# Altium project FluidGuard(Tx).PrjPcb (part 2 of 2)

## Sheet USB-PD.SchDoc: USB-PD CHARGER
size A4; SheetNumber: 2; SheetTotal: 5; DOC_NO_SCH_DWG: #022024031001
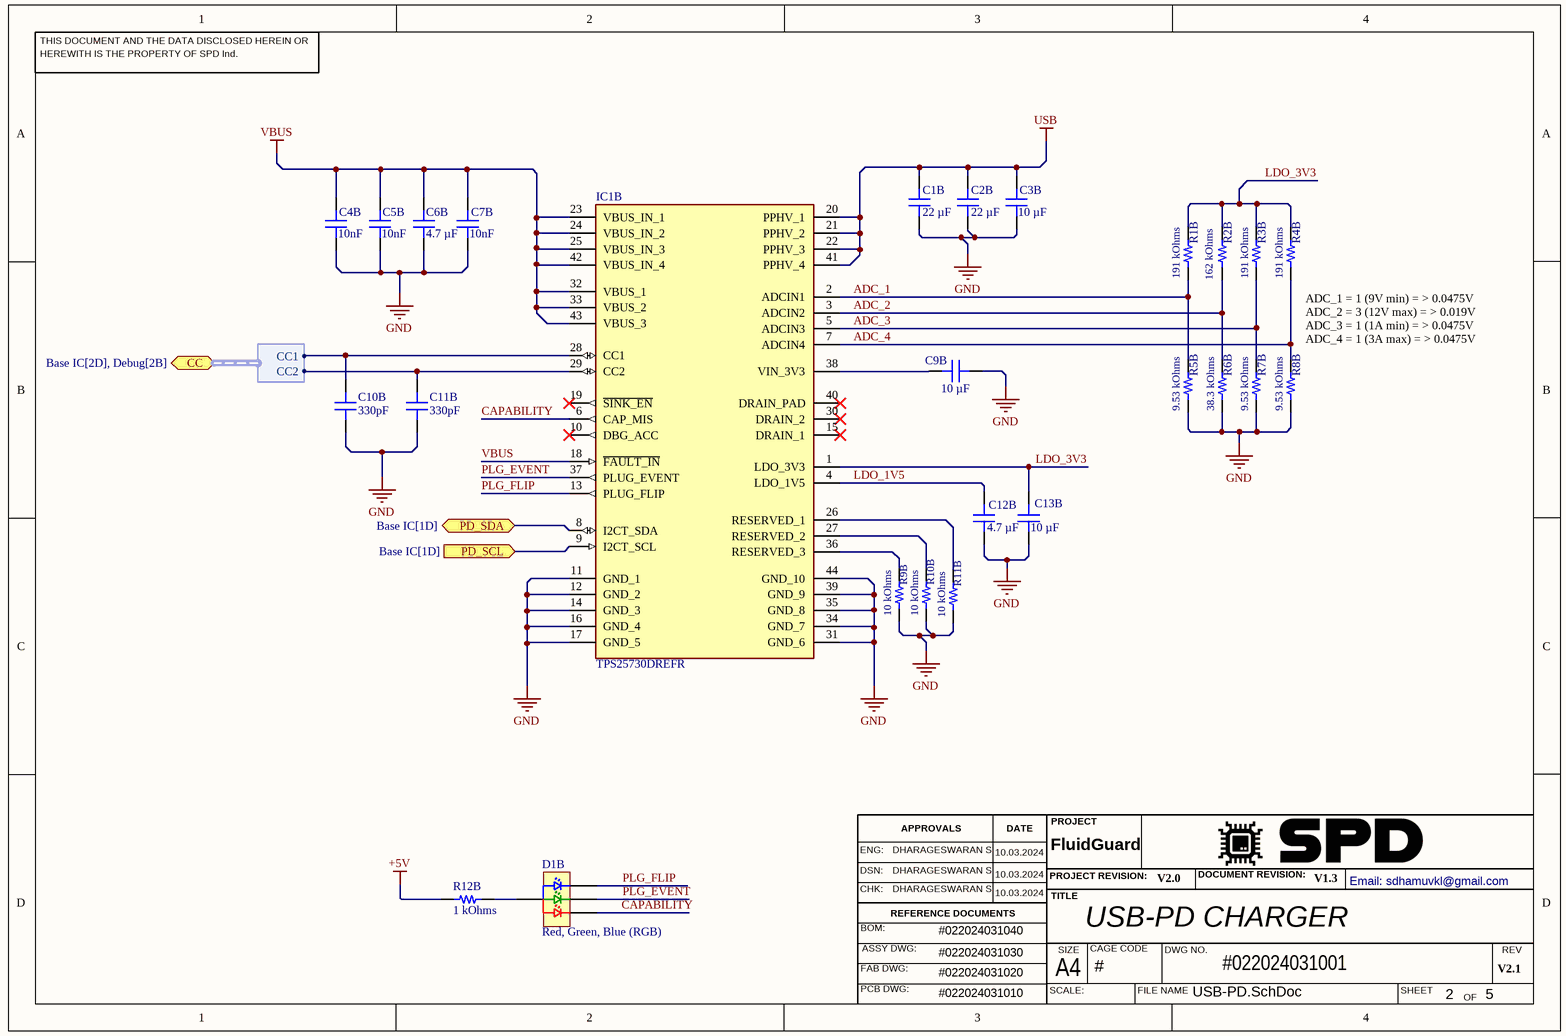
[diagram p3: USB-PD.SchDoc]

### Parts
C1B  22 µF  [CAP 0603_1608]
C2B  22 µF  [CAP 0603_1608]
C3B  10 µF  [CAP 0603_1608]
C4B  10nF  [CAP 0402_1005]
C5B  10nF  [CAP 0402_1005]
C6B  4.7 µF  [CAP 0402_1005]
C7B  10nF  [CAP 0402_1005]
C9B  10 µF  [CAP 0603_1608]
C10B  330pF  [CAP 0402_1005]
C11B  330pF  [CAP 0402_1005]
C12B  4.7 µF  [CAP 0402_1005]
C13B  10 µF  [CAP 0603_1608]
D1B  Red, Green, Blue (RGB)  [Harvatek B38G3RGB-10D0003H2U1930]
IC1B  TPS25730DREFR  [TPS25730DREFR]
R1B  191 kOhms  [RES 0402_1005]
R2B  162 kOhms  [RES 0402_1005]
R3B  191 kOhms  [RES 0402_1005]
R4B  191 kOhms  [RES 0402_1005]
R5B  9.53 kOhms  [RES 0402_1005]
R6B  38.3 kOhms  [RES 0402_1005]
R7B  9.53 kOhms  [RES 0402_1005]
R8B  9.53 kOhms  [RES 0402_1005]
R9B  10 kOhms  [RES 0402_1005]
R10B  10 kOhms  [RES 0402_1005]
R11B  10 kOhms  [RES 0402_1005]
R12B  1 kOhms  [RES 0603_1608]

### Ports
CC (bidir, harness CC, see Base IC[2D], Debug[2B]), PD_SCL (in, see Base IC[1D]), PD_SDA (bidir, see Base IC[1D])

### Harnesses
CC: CC1, CC2

### Nets
+5V: R12B.1
GND: C1B.1 C2B.1 C3B.2 C4B.1 C5B.1 C6B.1 C7B.1 C9B.1 C10B.1 C11B.1 C12B.1 C13B.1 IC1B.11(GND_1) IC1B.12(GND_2) IC1B.14(GND_3) IC1B.16(GND_4) IC1B.17(GND_5) IC1B.31(GND_6) IC1B.34(GND_7) IC1B.35(GND_8) IC1B.39(GND_9) IC1B.44(GND_10) R5B.1 R6B.1 R7B.1 R8B.1 R9B.2 R10B.2 R11B.2
USB: C1B.2 C2B.2 C3B.1 IC1B.20(PPHV_1) IC1B.21(PPHV_2) IC1B.22(PPHV_3) IC1B.41(PPHV_4)
VBUS: C4B.2 C5B.2 C6B.2 C7B.2 IC1B.18(~{FAULT_IN}) IC1B.23(VBUS_IN_1) IC1B.24(VBUS_IN_2) IC1B.25(VBUS_IN_3) IC1B.32(VBUS_1) IC1B.33(VBUS_2) IC1B.42(VBUS_IN_4) IC1B.43(VBUS_3)
ADC_1: IC1B.2(ADCIN1) R1B.1 R5B.2
ADC_2: IC1B.3(ADCIN2) R2B.1 R6B.2
ADC_3: IC1B.5(ADCIN3) R3B.1 R7B.2
ADC_4: IC1B.7(ADCIN4) R4B.1 R8B.2
CAPABILITY: D1B.4(RED) IC1B.6(CAP_MIS)
CC1: C10B.2 IC1B.28(CC1) ; port CC.CC1
CC2: C11B.2 IC1B.29(CC2) ; port CC.CC2
LDO_1V5: C12B.2 IC1B.4(LDO_1V5)
LDO_3V3: C13B.2 IC1B.1(LDO_3V3) R1B.2 R2B.2 R3B.2 R4B.2
PD_SCL: IC1B.9(I2CT_SCL) ; port PD_SCL
PD_SDA: IC1B.8(I2CT_SDA) ; port PD_SDA
PLG_EVENT: D1B.1(GREEN) IC1B.37(PLUG_EVENT)
PLG_FLIP: D1B.2(BLUE) IC1B.13(PLUG_FLIP)
NetC9B_2: C9B.2 IC1B.38(VIN_3V3)
NetD1B_3: D1B.3(ANODE) R12B.2
NetIC1B_26: IC1B.26(RESERVED_1) R11B.1
NetIC1B_27: IC1B.27(RESERVED_2) R10B.1
NetIC1B_36: IC1B.36(RESERVED_3) R9B.1

Not connected (* = marked no-connect by the designer): IC1B 10(DBG_ACC)* 15(DRAIN_1)* 19(~{SINK_EN})* 30(DRAIN_2)* 40(DRAIN_PAD)*

### Notes on the sheet
- ADC_1 = 1 (9V min) = > 0.0475V
  ADC_2 = 3 (12V max) = > 0.019V
  ADC_3 = 1 (1A min) = > 0.0475V
  ADC_4 = 1 (3A max) = > 0.0475V
- THIS DOCUMENT AND THE DATA DISCLOSED HEREIN OR
- HEREWITH IS THE PROPERTY OF SPD Ind.
- ENG:
- DHARAGESWARAN S
- APPROVALS
- DATE
- PROJECT
- DSN:
- CHK:
- REFERENCE DOCUMENTS
- PROJECT REVISION:
- TITLE
- DOCUMENT REVISION:
- Email: sdhamuvkl@gmail.com <https://github.com/DhamuVkl>
- BOM:
- FAB DWG:
- PCB DWG:
- ASSY DWG:
- SCALE:
- A4
- SIZE
- CAGE CODE
- FILE NAME
- DWG NO.
- SHEET
- REV
- OF

### Library data of the parts
C1B C2B = CL10A226MO7JZNC: CAP CER 22UF 16V X5R 0603; Manufacturer: Samsung Electro-Mechanics; id: 3280; Tolerance: ±20%; Part Number: CL10A226MO7JZNC; Value: 22 µF; Temperature Coefficient: X5R; Supplier Part Number 1: 1276-7076-1-ND; ComponentLink2Description: DigiKey Link; ComponentLink1URL: http://www.samsungsem.com/kr/support/product-search/mlcc/CL10A226MO7JZNC.jsp; PartId: 15245; Supplier 1: DigiKey; Series: CL; LastUpdated: 2023-01-03T20:07:09.957; Part Status: Active; Capacitance: 22 µF; Device Package: 0603 (1608 Metric); Thickness (Max): 0.031" (0.80mm); Voltage - Rated: 16V; Minimum Order: 1; Packaging: TapeAndReel; Applications: General Purpose; Package / Case: 0603 (1608 Metric); ComponentLink1Description: Datasheet; Price: 0.14; ComponentLink2URL: https://www.digikey.com/en/products/detail/samsung-electro-mechanics/CL10A226MO7JZNC/7320581; Lifecycle Status: Active; Operating Temperature: -55°C ~ 85°C; Size / Dimension: 0.063" L x 0.031" W (1.60mm x 0.80mm); Mounting Type: Surface Mount, MLCC
C3B C9B C13B = GRM188R61E106KA73D: CAP CER 10UF 25V X5R 0603; Manufacturer: Murata Electronics; id: 2462; Tolerance: ±10%; Part Number: GRM188R61E106KA73D; Value: 10 µF; Temperature Coefficient: X5R; Supplier Part Number 1: 490-18214-1-ND; ComponentLink2Description: DigiKey Link; ComponentLink1URL: https://search.murata.co.jp/Ceramy/image/img/A01X/G101/ENG/GRM188R61E106KA73-01.pdf; PartId: 12669; Supplier 1: DigiKey; Series: GRM; LastUpdated: 2023-01-03T20:07:18.763; Part Status: Active; Capacitance: 10 µF; Device Package: 0603 (1608 Metric); Thickness (Max): 0.039" (1.00mm); Voltage - Rated: 25V; Minimum Order: 1; Packaging: TapeAndReel; Applications: General Purpose; Package / Case: 0603 (1608 Metric); ComponentLink1Description: Datasheet; Price: 0.04; ComponentLink2URL: https://www.digikey.com/en/products/detail/murata-electronics/GRM188R61E106KA73D/9867922; Lifecycle Status: Active; Operating Temperature: -55°C ~ 85°C; Size / Dimension: 0.063" L x 0.031" W (1.60mm x 0.80mm); Mounting Type: Surface Mount, MLCC
C4B C5B C7B = C0402C103J5RECAUTO: CAP CER 0402 10NF 50V X7R 5%; Manufacturer: KEMET; id: 3927; Value: 10000 pF; Part Number: C0402C103J5RECAUTO; Temperature Coefficient: X7R; Supplier Part Number 1: 399-C0402C103J5RECAUTOCT-ND; ComponentLink2Description: DigiKey Link; ComponentLink1URL: https://api.kemet.com/component-edge/download/datasheet/C0402C103J5RECAUTO.pdf; PartId: 33153; Tolerance: ±5%; Supplier 1: DigiKey; Series: ESD SMD Auto X7R; LastUpdated: 2023-01-03T20:03:32.240; Part Status: Active; Capacitance: 10000 pF; Device Package: 0402 (1005 Metric); Ratings: AEC-Q200; Thickness (Max): 0.022" (0.55mm); Voltage - Rated: 50V; Minimum Order: 1; Packaging: TapeAndReel; Applications: Automotive, ESD Protection; Package / Case: 0402 (1005 Metric); ComponentLink1Description: Datasheet; Price: 0.02; ComponentLink2URL: https://www.digikey.com/en/products/detail/kemet/C0402C103J5RECAUTO/8646448; Lifecycle Status: Active; Operating Temperature: -55°C ~ 125°C; Size / Dimension: 0.039" L x 0.020" W (1.00mm x 0.50mm); Mounting Type: Surface Mount, MLCC
C6B C12B = GMC04X5R475K10NT: CAP0402 X5R 4.7UF 10% 10V; Manufacturer: Cal-Chip Electronics, Inc.; id: 6422; Part Number: GMC04X5R475K10NT; Value: 4.7 µF; Temperature Coefficient: X5R; Supplier Part Number 1: 4713-GMC04X5R475K10NTCT-ND; ComponentLink2Description: DigiKey Link; ComponentLink1URL: https://88ce57.p3cdn1.secureserver.net/wp-content/uploads/2023/01/gmc_series-2.pdf; PartId: 49814; Tolerance: ±10%; Supplier 1: DigiKey; Series: GMC; LastUpdated: 2023-04-21T19:03:30.743; Part Status: Active; Capacitance: 4.7 µF; Device Package: 0402 (1005 Metric); Thickness (Max): 0.028" (0.70mm); Voltage - Rated: 10V; Minimum Order: 1; Packaging: TapeAndReel; Applications: General Purpose; Package / Case: 0402 (1005 Metric); ComponentLink1Description: Datasheet; Price: 0.01; ComponentLink2URL: https://www.digikey.com/en/products/detail/cal-chip-electronics-inc/GMC04X5R475K10NT/18151135; Lifecycle Status: Active; Operating Temperature: -55°C ~ 85°C; Size / Dimension: 0.039" L x 0.020" W (1.00mm x 0.50mm); Mounting Type: Surface Mount, MLCC
C10B C11B = 0402YA331JAT2A: CAP CER 330PF 16V NP0 0402; Manufacturer: AVX Corporation; id: 3428; Temperature Coefficient: C0G, NP0; Tolerance: ±5%; Part Number: 0402YA331JAT2A; Value: 330pF; Supplier Part Number 1: 478-0402YA331JAT2ACT-ND; ComponentLink2Description: DigiKey Link; ComponentLink1URL: http://datasheets.avx.com/C0GNP0-Dielectric.pdf; PartId: 27100; Supplier 1: DigiKey; Series: -; LastUpdated: 2022-02-08T12:26:34.560; Part Status: Active; Capacitance: 330pF; Device Package: 0402 (1005 Metric); Voltage - Rated: 16V; Minimum Order: 1; Packaging: TapeAndReel; Applications: General Purpose; Package / Case: 0402 (1005 Metric); ComponentLink1Description: Datasheet; Price: 0.01; ComponentLink2URL: http://digikey.com/product-detail/en/avx-corporation/0402YA331JAT2A/478-0402YA331JAT2ACT-ND/11570207; Lifecycle Status: Active; Operating Temperature: -55°C ~ 125°C; Mounting Type: Surface Mount, MLCC
D1B = B38G3RGB-10D0003H2U1930: LED RGB MIXED WHITE ( 1.6(L)X1.6; Manufacturer: Harvatek Corporation; id: 1399; Lens Style: Rectangle with Flat Top; Lens Size: 1.60mm x 1.10mm; Configuration: Common Anode; Voltage - Forward (Vf) (Typ): 2V Red, 3V Green, 3V Blue; Current - Test: 10mA Red, 10mA Green, 10mA Blue; Millicandela Rating: 630mcd Red, 630mcd Green, 630mcd Blue; Part Number: B38G3RGB-10D0003H2U1930; Supplier Part Number 1: 3147-B38G3RGB-10D0003H2U1930CT-ND; Supplier Device Package: 0606; ComponentLink1Description: Datasheet; Color: Red, Green, Blue (RGB); ComponentLink2URL: https://www.digikey.com/en/products/detail/harvatek-corporation/B38G3RGB-10D0003H2U1930/13588733; ComponentLink1URL: https://media.digikey.com/pdf/Data%20Sheets/Harvatek%20PDFs/B38G3RGB-10D0003H2U1930%20%20V1.9.pdf; Supplier 1: DigiKey; Series: -; Height (Max): 0.50mm; Part Status: Active; ComponentLink2Description: DigiKey Link; Packaging: TapeAndReel; Minimum Order: 1; PartId: 1416; Lifecycle Status: Active; LastUpdated: 2023-10-31T16:54:14.060; Value: Red, Green, Blue (RGB); Size / Dimension: 1.60mm L x 1.60mm W; Mounting Type: Surface Mount; Price: 0.11
IC1B = TPS25730DREFR: USB PD Controller; Manufacturer_Name: Texas Instruments; Datasheet Link: https://www.ti.com/lit/ds/symlink/tps25730.pdf?ts=1707773923998&ref_url=https%253A%252F%252Fwww.mouser.at%252F; Height: 0.8mm; Manufacturer_Part_Number: TPS25730DREFR; Mouser Part Number: 595-TPS25730DREFR; Mouser Price/Stock: https://www.mouser.co.uk/ProductDetail/Texas-Instruments/TPS25730DREFR?qs=Z%252BL2brAPG1IvmkUK7DRnBA%3D%3D; Supplier 1: Mouser; Supplier Part Number 1: 595-TPS25730DREFR
R1B R3B R4B = AC0402FR-07191KL: RES SMD 191K OHM 1% 1/16W 0402; Manufacturer: Yageo; id: 11854; Temperature Coefficient: ±100ppm/°C; Power (Watts): 0.063W, 1/16W; Part Number: AC0402FR-07191KL; Height - Seated (Max): 0.015" (0.37mm); Supplier Part Number 1: 13-AC0402FR-07191KLCT-ND; Supplier Device Package: 0402; ComponentLink1Description: Datasheet; ComponentLink2URL: https://www.digikey.com/en/products/detail/yageo/AC0402FR-07191KL/5895119; Features: Automotive AEC-Q200, Moisture Resistant; ComponentLink1URL: https://www.yageo.com/upload/media/product/productsearch/datasheet/rchip/PYu-AC_51_RoHS_L_8.pdf; Composition: Thick Film; Tolerance: ±1%; Supplier 1: DigiKey; Series: AC; Part Status: Active; ComponentLink2Description: DigiKey Link; Device Package: 0402 (1005 Metric); Packaging: CutTape; Ratings: AEC-Q200; Minimum Order: 1; Package / Case: 0402 (1005 Metric); PartId: 60441; Lifecycle Status: Active; LastUpdated: 2023-01-02T20:20:21.097; Operating Temperature: -55°C ~ 155°C; Number Of Terminations: 2; Value: 191 kOhms; Size / Dimension: 0.039" L x 0.020" W (1.00mm x 0.50mm); Price: 0.01; Resistance: 191 kOhms
R2B = CR0402-FX-1623GLF: RES SMD 162K OHM 1% 1/16W 0402; Manufacturer: Bourns Inc.; id: 4470; Temperature Coefficient: ±100ppm/°C; Power (Watts): 0.063W, 1/16W; Part Number: CR0402-FX-1623GLF; Height - Seated (Max): 0.016" (0.40mm); Supplier Part Number 1: CR0402-FX-1623GLFCT-ND; Supplier Device Package: 0402; ComponentLink1Description: Datasheet; ComponentLink2URL: https://www.digikey.com/en/products/detail/bourns-inc/CR0402-FX-1623GLF/3783178; ComponentLink1URL: https://www.bourns.com/docs/Product-Datasheets/CR0402.pdf; Composition: Thick Film; Tolerance: ±1%; Supplier 1: DigiKey; Series: CR0402; Part Status: Active; ComponentLink2Description: DigiKey Link; Device Package: 0402 (1005 Metric); Packaging: CutTape; Minimum Order: 1; Package / Case: 0402 (1005 Metric); PartId: 11053; Lifecycle Status: Active; LastUpdated: 2023-01-02T20:21:14.190; Operating Temperature: -55°C ~ 155°C; Number Of Terminations: 2; Value: 162 kOhms; Size / Dimension: 0.039" L x 0.020" W (1.00mm x 0.50mm); Price: 0.01; Resistance: 162 kOhms
R5B R7B R8B = CRCW04029K53FKEDC: RES 9.53K OHM 1% 1/16W 0402; Manufacturer: Vishay Dale; id: 12430; Temperature Coefficient: ±100ppm/°C; Power (Watts): 0.063W, 1/16W; Part Number: CRCW04029K53FKEDC; Height - Seated (Max): 0.014" (0.35mm); Supplier Part Number 1: 541-5131-1-ND; Supplier Device Package: 0402; ComponentLink1Description: Datasheet; ComponentLink2URL: https://www.digikey.com/en/products/detail/vishay-dale/CRCW04029K53FKEDC/7925987; ComponentLink1URL: https://www.vishay.com/docs/28773/crcwce3.pdf; Composition: Thick Film; Tolerance: ±1%; Supplier 1: DigiKey; Series: CRCW-C; Part Status: Active; ComponentLink2Description: DigiKey Link; Device Package: 0402 (1005 Metric); Packaging: CutTape; Minimum Order: 1; Package / Case: 0402 (1005 Metric); PartId: 66777; Lifecycle Status: Active; LastUpdated: 2023-01-02T20:20:02.490; Operating Temperature: -55°C ~ 155°C; Number Of Terminations: 2; Value: 9.53 kOhms; Size / Dimension: 0.039" L x 0.020" W (1.00mm x 0.50mm); Price: 0.10; Resistance: 9.53 kOhms
R6B = AC0402FR-0738K3L: RES SMD 38.3K OHM 1% 1/16W 0402; Manufacturer: Yageo; id: 12409; Temperature Coefficient: ±100ppm/°C; Power (Watts): 0.063W, 1/16W; Part Number: AC0402FR-0738K3L; Height - Seated (Max): 0.015" (0.37mm); Supplier Part Number 1: 13-AC0402FR-0738K3LCT-ND; Supplier Device Package: 0402; ComponentLink1Description: Datasheet; ComponentLink2URL: https://www.digikey.com/en/products/detail/yageo/AC0402FR-0738K3L/5895312; Features: Automotive AEC-Q200, Moisture Resistant; ComponentLink1URL: https://www.yageo.com/upload/media/product/productsearch/datasheet/rchip/PYu-AC_51_RoHS_L_8.pdf; Composition: Thick Film; Tolerance: ±1%; Supplier 1: DigiKey; Series: AC; Part Status: Active; ComponentLink2Description: DigiKey Link; Device Package: 0402 (1005 Metric); Packaging: CutTape; Ratings: AEC-Q200; Minimum Order: 1; Package / Case: 0402 (1005 Metric); PartId: 65263; Lifecycle Status: Active; LastUpdated: 2023-01-02T20:20:08.577; Operating Temperature: -55°C ~ 155°C; Number Of Terminations: 2; Value: 38.3 kOhms; Size / Dimension: 0.039" L x 0.020" W (1.00mm x 0.50mm); Price: 0.01; Resistance: 38.3 kOhms
R9B R10B R11B = AC0402FR-1310KL: RES 10K OHM 1% 1/16W 0402; Manufacturer: Yageo; id: 13132; Temperature Coefficient: ±100ppm/°C; Power (Watts): 0.063W, 1/16W; Part Number: AC0402FR-1310KL; Height - Seated (Max): 0.015" (0.37mm); Supplier Part Number 1: 13-AC0402FR-1310KLCT-ND; Supplier Device Package: 0402; ComponentLink1Description: Datasheet; ComponentLink2URL: https://www.digikey.com/en/products/detail/yageo/AC0402FR-1310KL/12756397; Features: Automotive AEC-Q200, Moisture Resistant; ComponentLink1URL: https://www.yageo.com/upload/media/product/productsearch/datasheet/rchip/PYu-AC_51_RoHS_L_8.pdf; Composition: Thick Film; Tolerance: ±1%; Supplier 1: DigiKey; Series: AC; Part Status: Active; ComponentLink2Description: DigiKey Link; Device Package: 0402 (1005 Metric); Packaging: CutTape; Ratings: AEC-Q200; Minimum Order: 1; Package / Case: 0402 (1005 Metric); PartId: 69220; Lifecycle Status: Active; LastUpdated: 2023-01-02T20:19:54.633; Operating Temperature: -55°C ~ 155°C; Number Of Terminations: 2; Value: 10 kOhms; Size / Dimension: 0.039" L x 0.020" W (1.00mm x 0.50mm); Price: 0.01; Resistance: 10 kOhms
R12B = RMCF0603JT1K00: RES 1K OHM 5% 1/10W 0603; Manufacturer: Stackpole Electronics Inc; id: 454; Temperature Coefficient: ±200ppm/°C; Power (Watts): 0.1W, 1/10W; Part Number: RMCF0603JT1K00; Height - Seated (Max): 0.022" (0.55mm); Supplier Part Number 1: RMCF0603JT1K00CT-ND; Supplier Device Package: 0603; ComponentLink1Description: Datasheet; ComponentLink2URL: https://www.digikey.com/en/products/detail/stackpole-electronics-inc/RMCF0603JT1K00/1758057; Features: Automotive AEC-Q200; ComponentLink1URL: https://www.seielect.com/catalog/sei-rmcf_rmcp.pdf; Composition: Thick Film; Tolerance: ±5%; Supplier 1: DigiKey; Series: RMCF; Part Status: Active; ComponentLink2Description: DigiKey Link; Device Package: 0603 (1608 Metric); Packaging: CutTape; Ratings: AEC-Q200; Minimum Order: 1; Package / Case: 0603 (1608 Metric); PartId: 5824; Lifecycle Status: Active; LastUpdated: 2023-01-02T20:30:23.167; Operating Temperature: -55°C ~ 155°C; Number Of Terminations: 2; Value: 1 kOhms; Size / Dimension: 0.061" L x 0.031" W (1.55mm x 0.80mm); Price: 0.01; Resistance: 1 kOhms

## Sheet BMS.SchDoc: BMS BLOCK
size A4; SheetNumber: 4; SheetTotal: 5; DOC_NO_SCH_DWG: #022024031003
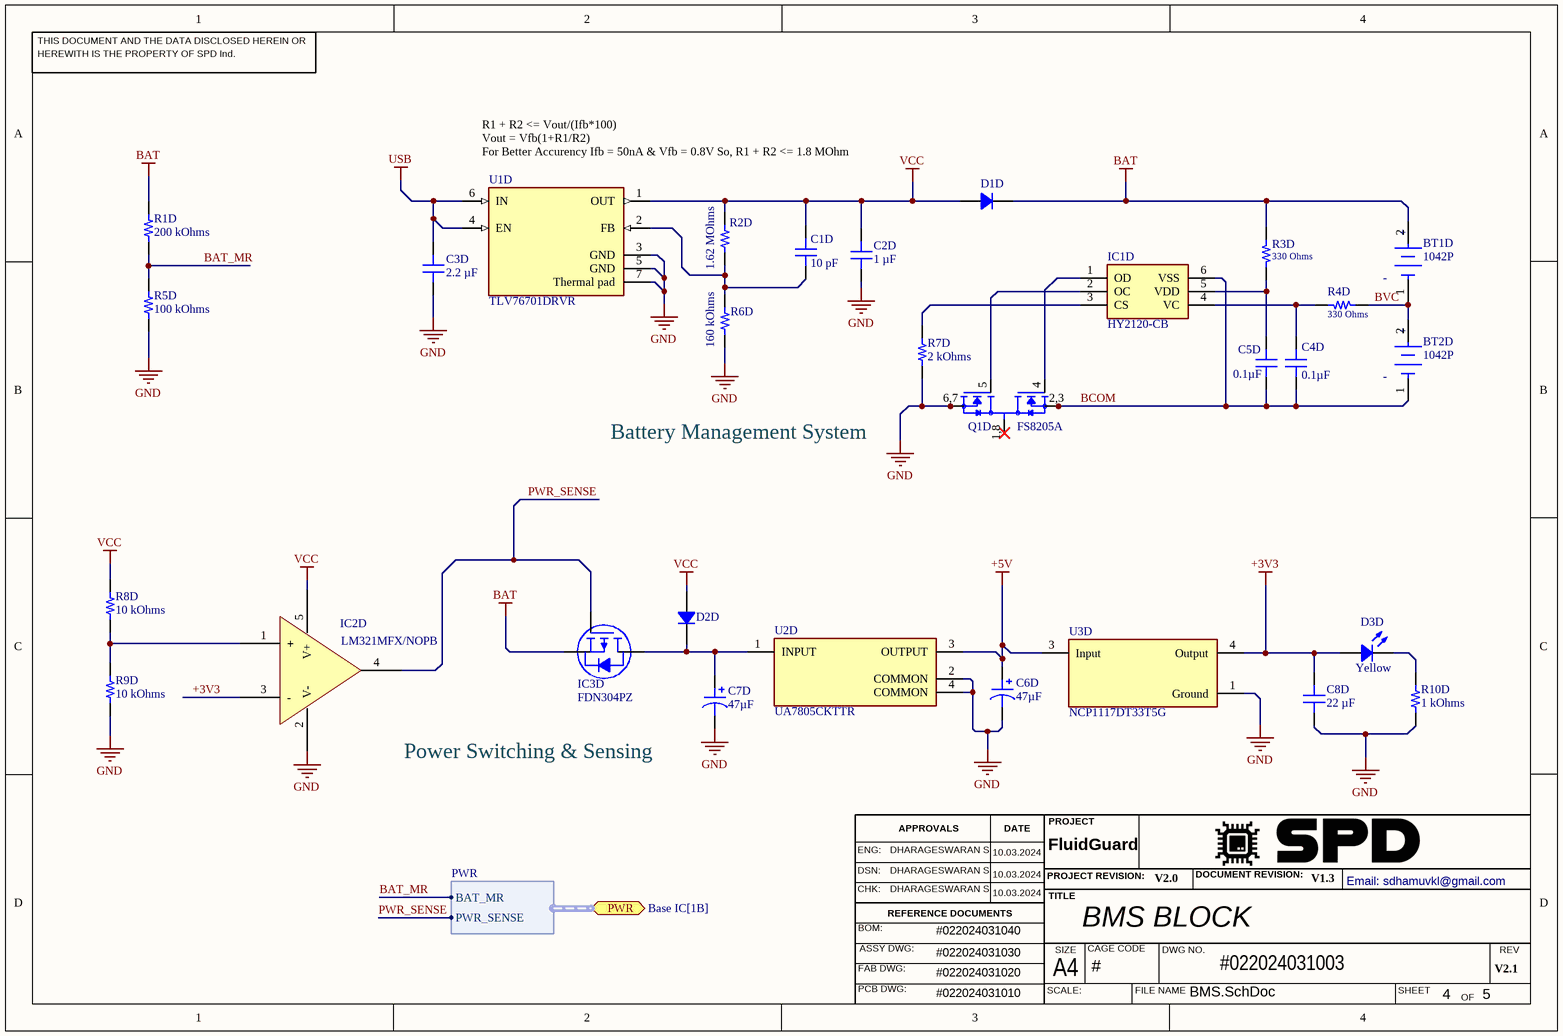
[diagram p4: BMS.SchDoc]

### Parts
BT1D  1042P  [FP-1042P-MFG]
BT2D  1042P  [FP-1042P-MFG]
C1D  10 pF  [CAP 0603_1608]
C2D  1 µF  [CAP 0603_1608]
C3D  2.2 µF  [CAP 0603_1608]
C4D  0.1µF  [CAP 0603_1608]
C5D  0.1µF  [CAP 0603_1608]
C6D  47µF  [CAP ALSMD 6.6MM H5.4MM]
C7D  47µF  [CAP ALSMD 6.6MM H5.4MM]
C8D  22 µF  [CAP 0402_1005]
D1D  RS1AB-13-F  [DO214AA SMB]  (value not drawn)
D2D  ES2A-13-F  [DO214AA SMB]  (value not drawn)
D3D  Yellow  [LED 0402_1005 YELLOW]
IC1D  HY2120-CB  [SOT95P280X140-6N]
IC2D  LM321MFX/NOPB  [TI SOT-23-5 DBV]
IC3D  FDN304PZ  [ON SEMI SOT-23-3]
Q1D  FS8205A  [SOP65P640X120-8N]
R1D  200 kOhms  [RES 1206_3216]
R2D  1.62 MOhms  [RES 0603_1608]
R3D  330 Ohms  [RES 0603_1608]
R4D  330 Ohms  [RES 0603_1608]
R5D  100 kOhms  [RES 1206_3216]
R6D  160 kOhms  [RES 0603_1608]
R7D  2 kOhms  [RES 0603_1608]
R8D  10 kOhms  [RES 0402_1005]
R9D  10 kOhms  [RES 0402_1005]
R10D  1 kOhms  [RES 0402_1005]
U1D  TLV76701DRVR  [FP-DRV0006A-IPC_C]
U2D  UA7805CKTTR  [FP-KTT0003A-MFG]
U3D  NCP1117DT33T5G  [FP-369C-MFG]

### Ports
PWR (bidir, harness PWR, see Base IC[1B])

### Harnesses
PWR: BAT_MR, PWR_SENSE

### Nets
+3V3: C8D.2 D3D.1 IC2D.3(-) U3D.4(Output)
+5V: C6D.1 U2D.3(OUTPUT) U3D.3(Input)
BAT: BT1D.2(A) D1D.2 IC3D.2(S) R1D.2 R3D.1
GND: C2D.1 C3D.1 C6D.2 C7D.2 C8D.1 IC2D.2(V-) Q1D.6(S2) Q1D.6,7(S2) R5D.1 R6D.1 R7D.1 R9D.1 R10D.1 U1D.3(GND) U1D.5(GND) U1D.7(Thermal_pad) U2D.2(COMMON) U2D.4(COMMON) U3D.1(Ground)
USB: C3D.2 U1D.4(EN) U1D.6(IN)
VCC: C1D.2 C2D.2 D1D.1 D2D.1 IC2D.5(V+) R2D.2 R8D.2 U1D.1(OUT)
BAT_MR: R1D.1 R5D.2 ; port PWR.BAT_MR
BCOM: BT2D.1(C) C4D.1 C5D.1 IC1D.6(VSS) Q1D.2(S1) Q1D.2,3(S1)
BVC: BT1D.1(C) BT2D.2(A) R4D.1
PWR_SENSE: IC2D.4(OUT) IC3D.1(G) ; port PWR.PWR_SENSE
NetC1D_1: C1D.1 R2D.1 R6D.2 U1D.2(FB)
NetC4D_2: C4D.2 IC1D.4(VC) R4D.2
NetC5D_2: C5D.2 IC1D.5(VDD) R3D.2
NetC7D_1: C7D.1 D2D.2 IC3D.3(D) U2D.1(INPUT)
NetD3D_2: D3D.2 R10D.2
NetIC1D_1: IC1D.1(OD) Q1D.4(G1)
NetIC1D_2: IC1D.2(OC) Q1D.5(G2)
NetIC1D_3: IC1D.3(CS) R7D.2
NetIC2D_1: IC2D.1(+) R8D.1 R9D.2
NetQ1D_1: Q1D.1(D12) Q1D.1,8(D12)

### Notes on the sheet
- (near U1D) R1 + R2 <= Vout/(Ifb*100)
  Vout = Vfb(1+R1/R2)
  For Better Accurency Ifb = 50nA & Vfb = 0.8V So, R1 + R2 <= 1.8 MOhm
- Battery Management System
- Power Switching & Sensing
- THIS DOCUMENT AND THE DATA DISCLOSED HEREIN OR
- HEREWITH IS THE PROPERTY OF SPD Ind.
- ENG:
- DHARAGESWARAN S
- APPROVALS
- DATE
- PROJECT
- DSN:
- CHK:
- REFERENCE DOCUMENTS
- PROJECT REVISION:
- TITLE
- DOCUMENT REVISION:
- Email: sdhamuvkl@gmail.com <https://github.com/DhamuVkl>
- BOM:
- FAB DWG:
- PCB DWG:
- ASSY DWG:
- SCALE:
- A4
- SIZE
- CAGE CODE
- FILE NAME
- DWG NO.
- SHEET
- REV
- OF
- (in symbol CMP-19636-000019-1) +; -

### Library data of the parts
BT1D BT2D = CMP-19636-000019-1: BATTERY HOLDER 18650 SMD TAB; Number of Cells: 1; Max Operating Temperature: 145°C; Termination: SMD/SMT; Mount: Surface Mount; Min Operating Temperature: -50°C; Package Quantity: 200; Packaging: Tray; Lead Free: Lead Free
C1D = 885012006017: CAP CER 10PF 16V C0G/NP0 0603; Manufacturer: Würth Elektronik; id: 4142; Temperature Coefficient: C0G, NP0; Tolerance: ±5%; Part Number: 885012006017; Value: 10 pF; Supplier Part Number 1: 732-7760-1-ND; ComponentLink2Description: DigiKey Link; ComponentLink1URL: https://katalog.we-online.de/pbs/datasheet/885012006017.pdf; PartId: 17575; Supplier 1: DigiKey; Series: WCAP-CSGP; LastUpdated: 2023-01-03T20:07:00.397; Part Status: Active; Capacitance: 10 pF; Device Package: 0603 (1608 Metric); Thickness (Max): 0.034" (0.87mm); Voltage - Rated: 16V; Minimum Order: 1; Packaging: TapeAndReel; Applications: General Purpose; Package / Case: 0603 (1608 Metric); ComponentLink1Description: Datasheet; Price: 0.02; ComponentLink2URL: https://www.digikey.com/en/products/detail/würth-elektronik/885012006017/5453615; Lifecycle Status: Active; Operating Temperature: -55°C ~ 125°C; Size / Dimension: 0.063" L x 0.031" W (1.60mm x 0.80mm); Mounting Type: Surface Mount, MLCC
C2D = CC0603ZRY5V7BB105: CAP CER 1UF 16V Y5V 0603; Manufacturer: Yageo; id: 744; Temperature Coefficient: Y5V (F); Tolerance: -20%, +80%; Part Number: CC0603ZRY5V7BB105; Value: 1 µF; Supplier Part Number 1: 311-1372-1-ND; ComponentLink2Description: DigiKey Link; ComponentLink1URL: http://www.yageo.com/documents/recent/UPY-GPHC_Y5V_6.3V-to-50V_8.pdf; PartId: 5227; Supplier 1: DigiKey; Series: CC; LastUpdated: 2023-01-03T20:07:40.173; Part Status: Active; Capacitance: 1 µF; Device Package: 0603 (1608 Metric); Thickness (Max): 0.035" (0.90mm); Voltage - Rated: 16V; Minimum Order: 1; Packaging: TapeAndReel; Applications: General Purpose; Package / Case: 0603 (1608 Metric); ComponentLink1Description: Datasheet; Price: 0.01; ComponentLink2URL: https://www.digikey.com/en/products/detail/yageo/CC0603ZRY5V7BB105/2103110; Lifecycle Status: Active; Operating Temperature: -30°C ~ 85°C; Size / Dimension: 0.063" L x 0.031" W (1.60mm x 0.80mm); Mounting Type: Surface Mount, MLCC
C3D = CC0603ZRY5V7BB225: CAP CER 2.2UF 16V Y5V 0603; Manufacturer: Yageo; id: 21; Temperature Coefficient: Y5V (F); Tolerance: -20%, +80%; Part Number: CC0603ZRY5V7BB225; Value: 2.2 µF; Supplier Part Number 1: 311-3416-1-ND; ComponentLink2Description: DigiKey Link; ComponentLink1URL: http://www.yageo.com/documents/recent/UPY-GPHC_Y5V_6.3V-to-50V_8.pdf; PartId: 2203; Supplier 1: DigiKey; Series: CC; LastUpdated: 2023-01-03T20:07:48.310; Part Status: Active; Capacitance: 2.2 µF; Device Package: 0603 (1608 Metric); Thickness (Max): 0.035" (0.90mm); Voltage - Rated: 16V; Minimum Order: 1; Packaging: TapeAndReel; Applications: General Purpose; Package / Case: 0603 (1608 Metric); ComponentLink1Description: Datasheet; Price: 0.01; ComponentLink2URL: https://www.digikey.com/en/products/detail/yageo/CC0603ZRY5V7BB225/5883851; Lifecycle Status: Active; Operating Temperature: -30°C ~ 85°C; Size / Dimension: 0.063" L x 0.031" W (1.60mm x 0.80mm); Mounting Type: Surface Mount, MLCC
C4D C5D = LD03YC104JAB2A: CAP CER 0.1UF 16V X7R 0603; Manufacturer: AVX Corporation; id: 1923; Tolerance: ±5%; Part Number: LD03YC104JAB2A; Value: 0.1µF; Temperature Coefficient: X7R; Supplier Part Number 1: 478-4928-1-ND; ComponentLink2Description: DigiKey Link; ComponentLink1URL: http://datasheets.avx.com/LD-Series.pdf; PartId: 10388; Supplier 1: DigiKey; Series: LD; LastUpdated: 2020-09-02T01:03:21.410; Part Status: Active; Capacitance: 0.1µF; Device Package: 0603 (1608 Metric); Thickness (Max): 0.035" (0.90mm); Voltage - Rated: 16V; Minimum Order: 1; Packaging: TapeAndReel; Applications: General Purpose; Package / Case: 0603 (1608 Metric); ComponentLink1Description: Datasheet; Price: 0.19; ComponentLink2URL: http://digikey.com/product-detail/en/avx-corporation/LD03YC104JAB2A/478-4928-1-ND/1858874; Lifecycle Status: Active; Operating Temperature: -55°C ~ 125°C; Size / Dimension: 0.063" L x 0.032" W (1.60mm x 0.81mm); Mounting Type: Surface Mount, MLCC
C6D C7D = EEE-HA1C470P: CAP ALUM 47UF 20% 16V SMD; Manufacturer: Panasonic Electronic Components; id: 1065; Ripple Current @ Low Frequency: 70mA @ 120Hz; Surface Mount Land Size: 0.260" L x 0.260" W (6.60mm x 6.60mm); Polarization: Polar; Lifetime @ Temp.: 1000 Hrs @ 105°C; Ripple Current @ High Frequency: 119mA @ 10kHz; Part Number: EEE-HA1C470P; Value: 47µF; Height - Seated (Max): 0.213" (5.40mm); Supplier Part Number 1: PCE4189CT-ND; ComponentLink2Description: DigiKey Link; ComponentLink1URL: https://industrial.panasonic.com/cdbs/www-data/pdf/RDE0000/ABA0000C1151.pdf; PartId: 8737; Tolerance: ±20%; Supplier 1: DigiKey; Series: HA; LastUpdated: 2020-09-02T01:18:32.593; Part Status: Active; Capacitance: 47µF; Device Package: Radial, Can - SMD; Ratings: AEC-Q200; Voltage - Rated: 16V; Minimum Order: 1; Packaging: TapeAndReel; Applications: Automotive; Package / Case: Radial, Can - SMD; ComponentLink1Description: Datasheet; Price: 0.08; ComponentLink2URL: http://digikey.com/product-detail/en/panasonic-electronic-components/EEE-HA1C470P/PCE4189CT-ND/814262; Lifecycle Status: Active; Operating Temperature: -40°C ~ 105°C; Size / Dimension: 0.248" Dia (6.30mm); Mounting Type: Surface Mount
C8D = GRM158R61A226ME15D: CAP CER 22UF 10V X5R 0402; Manufacturer: Murata Electronics; id: 5604; Tolerance: ±20%; Part Number: GRM158R61A226ME15D; Value: 22 µF; Temperature Coefficient: X5R; Supplier Part Number 1: 490-GRM158R61A226ME15DCT-ND; ComponentLink2Description: DigiKey Link; ComponentLink1URL: https://search.murata.co.jp/Ceramy/image/img/A01X/G101/ENG/GRM158R61A226ME15-01A.pdf; PartId: 44973; Supplier 1: DigiKey; Series: GRM; LastUpdated: 2023-01-03T20:03:20.787; Part Status: Active; Capacitance: 22 µF; Device Package: 0402 (1005 Metric); Thickness (Max): 0.031" (0.80mm); Voltage - Rated: 10V; Minimum Order: 1; Packaging: TapeAndReel; Applications: General Purpose; Package / Case: 0402 (1005 Metric); ComponentLink1Description: Datasheet; Price: 0.09; ComponentLink2URL: https://www.digikey.com/en/products/detail/murata-electronics/GRM158R61A226ME15D/16033379; Lifecycle Status: Active; Operating Temperature: -55°C ~ 85°C; Size / Dimension: 0.039" L x 0.020" W (1.00mm x 0.50mm); Mounting Type: Surface Mount, MLCC
D1D = RS1AB-13-F: DIODE GEN PURP 50V 1A SMB; Manufacturer: Diodes Incorporated; id: 27; Reverse Recovery Time (Trr): 150 ns; Capacitance @ Vr, F: 15pF @ 4V, 1MHz; Speed: Fast Recovery =< 500ns, > 200mA (Io); Voltage - Forward (Vf) (Max) @ If: 1.3 V @ 1 A; Diode Type: Standard; Current - Reverse Leakage @ Vr: 5 µA @ 50 V; Part Number: RS1AB-13-F; Supplier Part Number 1: RS1AB-FDICT-ND; Supplier Device Package: SMB; ComponentLink1Description: Datasheet; ComponentLink2URL: https://www.digikey.com/en/products/detail/diodes-incorporated/RS1AB-13-F/814456; ComponentLink1URL: https://www.diodes.com/assets/Datasheets/ds15002.pdf; Supplier 1: DigiKey; Series: -; Part Status: Active; ComponentLink2Description: DigiKey Link; Current - Average Rectified (Io): 1A; Operating Temperature - Junction: -65°C ~ 150°C; Packaging: TapeAndReel; Minimum Order: 1; Voltage - DC Reverse (Vr) (Max): 50 V; Package / Case: DO-214AA, SMB; PartId: 27; Lifecycle Status: Active; LastUpdated: 2023-01-02T20:53:12.200; Mounting Type: Surface Mount; Price: 0.07
D2D = ES2A-13-F: DIODE GEN PURP 50V 2A SMB; Manufacturer: Diodes Incorporated; id: 319; Reverse Recovery Time (Trr): 25 ns; Capacitance @ Vr, F: 25pF @ 4V, 1MHz; Speed: Fast Recovery =< 500ns, > 200mA (Io); Voltage - Forward (Vf) (Max) @ If: 920 mV @ 2 A; Diode Type: Standard; Current - Reverse Leakage @ Vr: 5 µA @ 50 V; Part Number: ES2A-13-F; Supplier Part Number 1: ES2A-FDICT-ND; Supplier Device Package: SMB; ComponentLink1Description: Datasheet; ComponentLink2URL: https://www.digikey.com/en/products/detail/diodes-incorporated/ES2A-13-F/815105; ComponentLink1URL: https://www.diodes.com/assets/Datasheets/ds14002.pdf; Supplier 1: DigiKey; Series: -; Part Status: Active; ComponentLink2Description: DigiKey Link; Current - Average Rectified (Io): 2A; Operating Temperature - Junction: -55°C ~ 150°C; Packaging: TapeAndReel; Minimum Order: 1; Voltage - DC Reverse (Vr) (Max): 50 V; Package / Case: DO-214AA, SMB; PartId: 319; Lifecycle Status: Active; LastUpdated: 2023-01-02T20:53:06.797; Mounting Type: Surface Mount; Price: 0.22
D3D = SM0402YC: LED YELLOW CLEAR 0402 SMD; Manufacturer: Bivar Inc.; id: 170; Lens Color: Colorless; Wavelength - Peak: 593nm; Lens Style: Rectangle with Flat Top; Viewing Angle: 130°; Lens Size: 0.50mm x 1.00mm; Configuration: 0402; Wavelength - Dominant: 592nm; Voltage - Forward (Vf) (Typ): 2V; Current - Test: 20mA; Millicandela Rating: 145mcd; Part Number: SM0402YC; Supplier Part Number 1: 492-2206-1-ND; Lens Transparency: Clear; Supplier Device Package: 0402; ComponentLink1Description: Datasheet; Color: Yellow; ComponentLink2URL: https://www.digikey.com/en/products/detail/bivar-inc/SM0402YC/6810862; ComponentLink1URL: https://www.bivar.com/Files/Datasheets/SM0402YC.pdf; Supplier 1: DigiKey; Series: -; Height (Max): 0.71mm; Part Status: Active; ComponentLink2Description: DigiKey Link; Device Package: 0402 (1005 Metric); Packaging: TapeAndReel; Minimum Order: 1; Package / Case: 0402 (1005 Metric); PartId: 170; Lifecycle Status: Active; LastUpdated: 2023-01-02T20:57:30.187; Value: Yellow; Size / Dimension: 1.00mm L x 0.50mm W; Mounting Type: Surface Mount; Price: 0.16
IC1D = HY2120-CB: BMS; Manufacturer_Name: Hycon; Datasheet Link: https://datasheet.lcsc.com/szlcsc/HYCON-Tech-HY2120CB_C116509.pdf; Height: 1.4mm; Manufacturer_Part_Number: HY2120-CB
IC2D = LM321MFX/NOPB: IC OPAMP GP 1 CIRCUIT SOT23-5; Manufacturer: Texas Instruments; id: 11; Voltage - Input Offset: 2mV; Slew Rate: 0.4V/µs; Number Of Circuits: 1; Current - Input Bias: 45nA; Gain Bandwidth Product: 1MHz; Amplifier Type: General Purpose; Current - Supply: 660µA; Voltage - Supply, Single/Dual (±): 3V ~ 30V, ±1.5V ~ 15V; Current - Output / Channel: 40mA; Part Number: LM321MFX/NOPB; Supplier Part Number 1: LM321MFX/NOPBCT-ND; Supplier Device Package: SOT-23-5; ComponentLink1Description: Datasheet; ComponentLink2URL: http://digikey.com/product-detail/en/texas-instruments/LM321MFX-NOPB/LM321MFX-NOPBCT-ND/3440175; ComponentLink1URL: http://www.ti.com/general/docs/suppproductinfo.tsp?distId=10&gotoUrl=http%3A%2F%2Fwww.ti.com%2Flit%2Fgpn%2Flm321; Supplier 1: DigiKey; Series: -; Part Status: Active; ComponentLink2Description: DigiKey Link; Device Package: SC-74A, SOT-753; Packaging: TapeAndReel; Minimum Order: 1; Package / Case: SC-74A, SOT-753; PartId: 11; Lifecycle Status: Active; LastUpdated: 2020-03-30T15:10:58.873; Operating Temperature: -40°C ~ 85°C; Mounting Type: Surface Mount; Price: 0.23
IC3D = FDN304PZ: MOSFET P-CH 20V 2.4A SSOT-3; Manufacturer: ON Semiconductor; id: 80; FET Type: P-Channel; Drive Voltage (Max Rds On,  Min Rds On): 1.8V, 4.5V; Power Dissipation (Max): 500mW (Ta); Vgs (Max): ±8V; Input Capacitance (Ciss) (Max) @ Vds: 1310pF @ 10V; Gate Charge (Qg) (Max) @ Vgs: 20nC @ 4.5V; Current - Continuous Drain (Id) @ 25°C: 2.4A (Ta); Rds On (Max) @ Id, Vgs: 52mOhm @ 2.4A, 4.5V; Vgs(Th) (Max) @ Id: 1.5V @ 250µA; Part Number: FDN304PZ; Supplier Part Number 1: FDN304PZCT-ND; Supplier Device Package: SuperSOT-3; ComponentLink1Description: Datasheet; ComponentLink2URL: http://digikey.com/product-detail/en/on-semiconductor/FDN304PZ/FDN304PZCT-ND/1849909; ComponentLink1URL: https://www.onsemi.com/pub/Collateral/FDN304PZ-D.pdf; Supplier 1: DigiKey; Series: PowerTrench®; Part Status: Active; ComponentLink2Description: DigiKey Link; Packaging: TapeAndReel; Minimum Order: 1; Drain To Source Voltage (Vdss): 20V; Package / Case: TO-236-3, SC-59, SOT-23-3; Lifecycle Status: Active; LastUpdated: 2023-01-02T21:05:00.863; Technology: MOSFET (Metal Oxide); Operating Temperature: -55°C ~ 150°C (TJ); Mounting Type: Surface Mount; Price: 0.18
Q1D = FS8205A: N/A; MF: Fortune Semiconductor; MP: FS8205A; Value: *; Availability: Not in stock; Package: Package; Price: None; SnapEDA_Link: https://www.snapeda.com/parts/FS8205A/Fortune+Semiconductor/view-part/?ref=snap; Check_prices: https://www.snapeda.com/parts/FS8205A/Fortune+Semiconductor/view-part/?ref=eda
R1D = ERA-8AEB204V: RES SMD 200K OHM 0.1% 1/4W 1206; Manufacturer: Panasonic Electronic Components; id: 4000; Temperature Coefficient: ±25ppm/°C; Power (Watts): 0.25W, 1/4W; Part Number: ERA-8AEB204V; Height - Seated (Max): 0.028" (0.70mm); Supplier Part Number 1: P200KBCCT-ND; Supplier Device Package: 1206; ComponentLink1Description: Datasheet; ComponentLink2URL: https://www.digikey.com/en/products/detail/panasonic-electronic-components/ERA-8AEB204V/3070868; Features: Automotive AEC-Q200; ComponentLink1URL: https://industrial.panasonic.com/cdbs/www-data/pdf/RDM0000/AOA0000C307.pdf; Composition: Thin Film; Tolerance: ±0.1%; Supplier 1: DigiKey; Series: ERA-8A; Part Status: Active; ComponentLink2Description: DigiKey Link; Device Package: 1206 (3216 Metric); Packaging: TapeAndReel; Ratings: AEC-Q200; Minimum Order: 1; Package / Case: 1206 (3216 Metric); PartId: 33994; Lifecycle Status: Active; LastUpdated: 2023-01-02T20:37:01.767; Operating Temperature: -55°C ~ 155°C; Number Of Terminations: 2; Value: 200 kOhms; Size / Dimension: 0.126" L x 0.063" W (3.20mm x 1.60mm); Price: 0.12; Resistance: 200 kOhms
R2D = RMCF0603FT1M62: RES 1.62M OHM 1% 1/10W 0603; Manufacturer: Stackpole Electronics Inc; id: 12536; Temperature Coefficient: ±200ppm/°C; Power (Watts): 0.1W, 1/10W; Part Number: RMCF0603FT1M62; Height - Seated (Max): 0.022" (0.55mm); Supplier Part Number 1: RMCF0603FT1M62CT-ND; Supplier Device Package: 0603; ComponentLink1Description: Datasheet; ComponentLink2URL: https://www.digikey.com/en/products/detail/stackpole-electronics-inc/RMCF0603FT1M62/1713506; Features: Automotive AEC-Q200; ComponentLink1URL: https://www.seielect.com/catalog/sei-rmcf_rmcp.pdf; Composition: Thick Film; Tolerance: ±1%; Supplier 1: DigiKey; Series: RMCF; Part Status: Active; ComponentLink2Description: DigiKey Link; Device Package: 0603 (1608 Metric); Packaging: CutTape; Ratings: AEC-Q200; Minimum Order: 1; Package / Case: 0603 (1608 Metric); PartId: 26334; Lifecycle Status: Active; LastUpdated: 2023-01-02T20:28:35.533; Operating Temperature: -55°C ~ 155°C; Number Of Terminations: 2; Value: 1.62 MOhms; Size / Dimension: 0.061" L x 0.031" W (1.55mm x 0.80mm); Price: 0.01; Resistance: 1.62 MOhms
R3D R4D = CRCW0603330RFKEAC: RES 330 OHM 1% 1/10W 0603; Manufacturer: Vishay Dale; id: 3752; Temperature Coefficient: ±100ppm/°C; Power (Watts): 0.1W, 1/10W; Part Number: CRCW0603330RFKEAC; Height - Seated (Max): 0.022" (0.55mm); Supplier Part Number 1: 541-4026-1-ND; Supplier Device Package: 0603; ComponentLink1Description: Datasheet; ComponentLink2URL: https://www.digikey.com/en/products/detail/vishay-dale/CRCW0603330RFKEAC/7928448; ComponentLink1URL: http://www.vishay.com/docs/28773/crcwce3.pdf; Composition: Thick Film; Tolerance: ±1%; Supplier 1: DigiKey; Series: CRCW-C; Part Status: Active; ComponentLink2Description: DigiKey Link; Device Package: 0603 (1608 Metric); Packaging: CutTape; Minimum Order: 1; Package / Case: 0603 (1608 Metric); PartId: 12584; Lifecycle Status: Active; LastUpdated: 2023-01-02T20:29:55.413; Operating Temperature: -55°C ~ 155°C; Number Of Terminations: 2; Value: 330 Ohms; Price: 0.01; Resistance: 330 Ohms
R5D = RT1206BRD07100KL: RES SMD 100K OHM 0.1% 1/4W 1206; Manufacturer: Yageo; id: 6936; Temperature Coefficient: ±25ppm/°C; Power (Watts): 0.25W, 1/4W; Part Number: RT1206BRD07100KL; Height - Seated (Max): 0.026" (0.65mm); Supplier Part Number 1: YAG2003CT-ND; Supplier Device Package: 1206; ComponentLink1Description: Datasheet; ComponentLink2URL: https://www.digikey.com/en/products/detail/yageo/RT1206BRD07100KL/1079461; ComponentLink1URL: https://www.yageo.com/upload/media/product/productsearch/datasheet/rchip/PYu-RT_1-to-0.01_RoHS_L_11.pdf; Composition: Thin Film; Tolerance: ±0.1%; Supplier 1: DigiKey; Series: RT; Part Status: Active; ComponentLink2Description: DigiKey Link; Device Package: 1206 (3216 Metric); Packaging: TapeAndReel; Minimum Order: 1; Package / Case: 1206 (3216 Metric); PartId: 39875; Lifecycle Status: Active; LastUpdated: 2023-01-02T20:36:33.687; Operating Temperature: -55°C ~ 155°C; Number Of Terminations: 2; Value: 100 kOhms; Size / Dimension: 0.122" L x 0.063" W (3.10mm x 1.60mm); Price: 0.10; Resistance: 100 kOhms
R6D = RMCF0603FG160K: RES 160K OHM 1% 1/10W 0603; Manufacturer: Stackpole Electronics Inc; id: 2352; Temperature Coefficient: ±100ppm/°C; Power (Watts): 0.1W, 1/10W; Part Number: RMCF0603FG160K; Height - Seated (Max): 0.022" (0.55mm); Supplier Part Number 1: 738-RMCF0603FG160KCT-ND; Supplier Device Package: 0603; ComponentLink1Description: Datasheet; ComponentLink2URL: https://www.digikey.com/en/products/detail/stackpole-electronics-inc/RMCF0603FG160K/1713653; Features: Automotive AEC-Q200; ComponentLink1URL: https://www.seielect.com/catalog/sei-rmcf_rmcp.pdf; Composition: Thick Film; Tolerance: ±1%; Supplier 1: DigiKey; Series: RMCF; Part Status: Active; ComponentLink2Description: DigiKey Link; Device Package: 0603 (1608 Metric); Packaging: CutTape; Ratings: AEC-Q200; Minimum Order: 1; Package / Case: 0603 (1608 Metric); PartId: 9704; Lifecycle Status: Active; LastUpdated: 2023-01-02T20:30:07.700; Operating Temperature: -55°C ~ 155°C; Number Of Terminations: 2; Value: 160 kOhms; Size / Dimension: 0.061" L x 0.031" W (1.55mm x 0.80mm); Price: 0.01; Resistance: 160 kOhms
R7D = RT0603BRD072KL: RES SMD 2K OHM 0.1% 1/10W 0603; Manufacturer: Yageo; id: 366; Temperature Coefficient: ±25ppm/°C; Power (Watts): 0.1W, 1/10W; Part Number: RT0603BRD072KL; Height - Seated (Max): 0.022" (0.55mm); Supplier Part Number 1: YAG1626CT-ND; Supplier Device Package: 0603; ComponentLink1Description: Datasheet; ComponentLink2URL: https://www.digikey.com/en/products/detail/yageo/RT0603BRD072KL/1072444; ComponentLink1URL: https://www.yageo.com/upload/media/product/productsearch/datasheet/rchip/PYu-RT_1-to-0.01_RoHS_L_11.pdf; Composition: Thin Film; Tolerance: ±0.1%; Supplier 1: DigiKey; Series: RT; Part Status: Active; ComponentLink2Description: DigiKey Link; Device Package: 0603 (1608 Metric); Packaging: TapeAndReel; Minimum Order: 1; Package / Case: 0603 (1608 Metric); PartId: 5635; Lifecycle Status: Active; LastUpdated: 2023-01-02T20:30:23.983; Operating Temperature: -55°C ~ 155°C; Number Of Terminations: 2; Value: 2 kOhms; Size / Dimension: 0.063" L x 0.031" W (1.60mm x 0.80mm); Price: 0.03; Resistance: 2 kOhms
R8D R9D = AA0402FR-0710KL: RES SMD 10K OHM 1% 1/16W 0402; Manufacturer: Yageo; id: 10610; Temperature Coefficient: ±150ppm/°C; Power (Watts): 0.063W, 1/16W; Part Number: AA0402FR-0710KL; Height - Seated (Max): 0.015" (0.37mm); Supplier Part Number 1: 13-AA0402FR-0710KLCT-ND; Supplier Device Package: 0402; ComponentLink1Description: Datasheet; ComponentLink2URL: https://www.digikey.com/en/products/detail/yageo/AA0402FR-0710KL/5887729; Features: Anti-Sulfur, Automotive AEC-Q200, Moisture Resistant; ComponentLink1URL: https://www.yageo.com/upload/media/product/productsearch/datasheet/rchip/PYu-AA_51_RoHS_L_3.pdf; Composition: Thick Film; Tolerance: ±1%; Supplier 1: DigiKey; Series: AA; Part Status: Active; ComponentLink2Description: DigiKey Link; Device Package: 0402 (1005 Metric); Packaging: TapeAndReel; Ratings: AEC-Q200; Minimum Order: 1; Package / Case: 0402 (1005 Metric); PartId: 59190; Lifecycle Status: Active; LastUpdated: 2023-01-02T20:20:10.303; Operating Temperature: -55°C ~ 155°C; Number Of Terminations: 2; Value: 10 kOhms; Size / Dimension: 0.039" L x 0.020" W (1.00mm x 0.50mm); Price: 0.01; Resistance: 10 kOhms
R10D = AA0402FR-071KL: RES SMD 1K OHM 1% 1/16W 0402; Manufacturer: Yageo; id: 10598; Temperature Coefficient: ±150ppm/°C; Power (Watts): 0.063W, 1/16W; Part Number: AA0402FR-071KL; Height - Seated (Max): 0.015" (0.37mm); Supplier Part Number 1: 13-AA0402FR-071KLCT-ND; Supplier Device Package: 0402; ComponentLink1Description: Datasheet; ComponentLink2URL: https://www.digikey.com/en/products/detail/yageo/AA0402FR-071KL/5887878; Features: Anti-Sulfur, Automotive AEC-Q200, Moisture Resistant; ComponentLink1URL: https://www.yageo.com/upload/media/product/productsearch/datasheet/rchip/PYu-AA_51_RoHS_L_3.pdf; Composition: Thick Film; Tolerance: ±1%; Supplier 1: DigiKey; Series: AA; Part Status: Active; ComponentLink2Description: DigiKey Link; Device Package: 0402 (1005 Metric); Packaging: TapeAndReel; Ratings: AEC-Q200; Minimum Order: 1; Package / Case: 0402 (1005 Metric); PartId: 59178; Lifecycle Status: Active; LastUpdated: 2023-01-02T20:20:10.210; Operating Temperature: -55°C ~ 155°C; Number Of Terminations: 2; Value: 1 kOhms; Size / Dimension: 0.039" L x 0.020" W (1.00mm x 0.50mm); Price: 0.01; Resistance: 1 kOhms
U1D = CMP-04917-000172-1: IC REG LINEAR POS ADJ 1A 6WSON
U2D = CMP-1685-00014-2: IC REG LIN 5V 1.5A DDPAK/TO263-3; Output Type: Fixed; Quiescent Current: 8mA; Dropout Voltage: 2V; Max Input Voltage: 25V; Number of Regulators: 1; Max Output Voltage: 5.2V; Polarity: Positive; Min Output Voltage: 4.8V; Power Supply Rejection Ratio (PSRR): 78dB; Min Input Voltage: 7V; Power Rating: 15W; Number of Pins: 3; Output Voltage: 5V; Max Output Current: 1.5A; Nominal Output Voltage: 5V; Case/Package: TO-263; Width: 9.65mm; REACH SVHC: No SVHC; Max Operating Temperature: 125°C; Output Current: 1.5A; Weight: 0.050897oz; Contact Plating: Tin; Packaging: Tape and Reel; Mount: Surface Mount; Radiation Hardening: No; Lead Free: Lead Free; Min Operating Temperature: 0°C; Length: 10.67mm; Package Quantity: 1; Number of Outputs: 1; Height: 4.83mm
U3D = CMP-07128-000023-2: IC REG LINEAR 3.3V 1A DPAK; Polarity: Positive; Input Bias Current: 6mA; Quiescent Current: 10mA; Output Type: Fixed; Number of Outputs: 1; Output Voltage Accuracy: 1%; Max Input Voltage: 20V; Dropout Voltage: 1.07V; Reference Voltage: 1.27V; Lead Free: Lead Free; Width: 6.22mm; Min Current Limit: 1A; Case/Package: DPAK; Output Voltage: 3.3V; Halogen Free: Halogen Free; Radiation Hardening: No; Min Operating Temperature: 0°C; Nominal Output Voltage: 3.3V; Output Current: 1A; Package Quantity: 1; Max Operating Temperature: 125°C; Max Output Current: 1A; Number of Regulators: 1; REACH SVHC: No SVHC; Packaging: Tape and Reel; Number of Pins: 3; Height: 2.38mm; Length: 6.73mm; Mount: Surface Mount; Contact Plating: Tin; Accuracy: 1%

## Nets that join several sheets
+3V3: Base IC (9 pins), Debug (SJ1E.2), BMS (C8D.2 D3D.1 IC2D.3 U3D.4)
+5V: Base IC (J1A.1), NRF2401 (C14C.2 U2C.4 U2C.6), USB-PD (R12B.1), BMS (C6D.1 U2D.3 U3D.3)
GND: Base IC (14 pins), Debug (5 pins), NRF2401 (42 pins), USB-PD (29 pins), BMS (19 pins)
USB: USB-PD (7 pins), BMS (C3D.2 U1D.4 U1D.6)
VBUS: Debug (J2E.A9 J2E.B9), USB-PD (12 pins)
BAT_MR: Base IC (U1A.14), BMS (R1D.1 R5D.2)
CC1: Debug (J2E.A5), USB-PD (C10B.2 IC1B.28)
CC2: Debug (J2E.B5), USB-PD (C11B.2 IC1B.29)
MCU SWCLK: Base IC (U1A.22), Debug (J1E.4)
MCU SWDIO: Base IC (U1A.21), Debug (J1E.2)
MCU_RESET: Base IC (C3A.2 S1A.1 U1A.4), Debug (J1E.3)
PD_SCL: Base IC (R7A.1 U1A.19), USB-PD (IC1B.9)
PD_SDA: Base IC (R6A.1 U1A.20), USB-PD (IC1B.8)
PWR_SENSE: Base IC (U1A.15), BMS (IC2D.4 IC3D.1)
RF_CE: Base IC (U1A.8), NRF2401 (IC1C.1 R3C.2)
RF_CSN: Base IC (U1A.9), NRF2401 (IC1C.2)
RF_IRQ: Base IC (U1A.10), NRF2401 (IC1C.6)
RF_MISO: Base IC (U1A.12), NRF2401 (IC1C.5)
RF_MOSI: Base IC (U1A.13), NRF2401 (IC1C.4)
RF_SCK: Base IC (U1A.11), NRF2401 (IC1C.3)